# EAGLE schematic ShutdownThree (EAGLE 7.7.0)
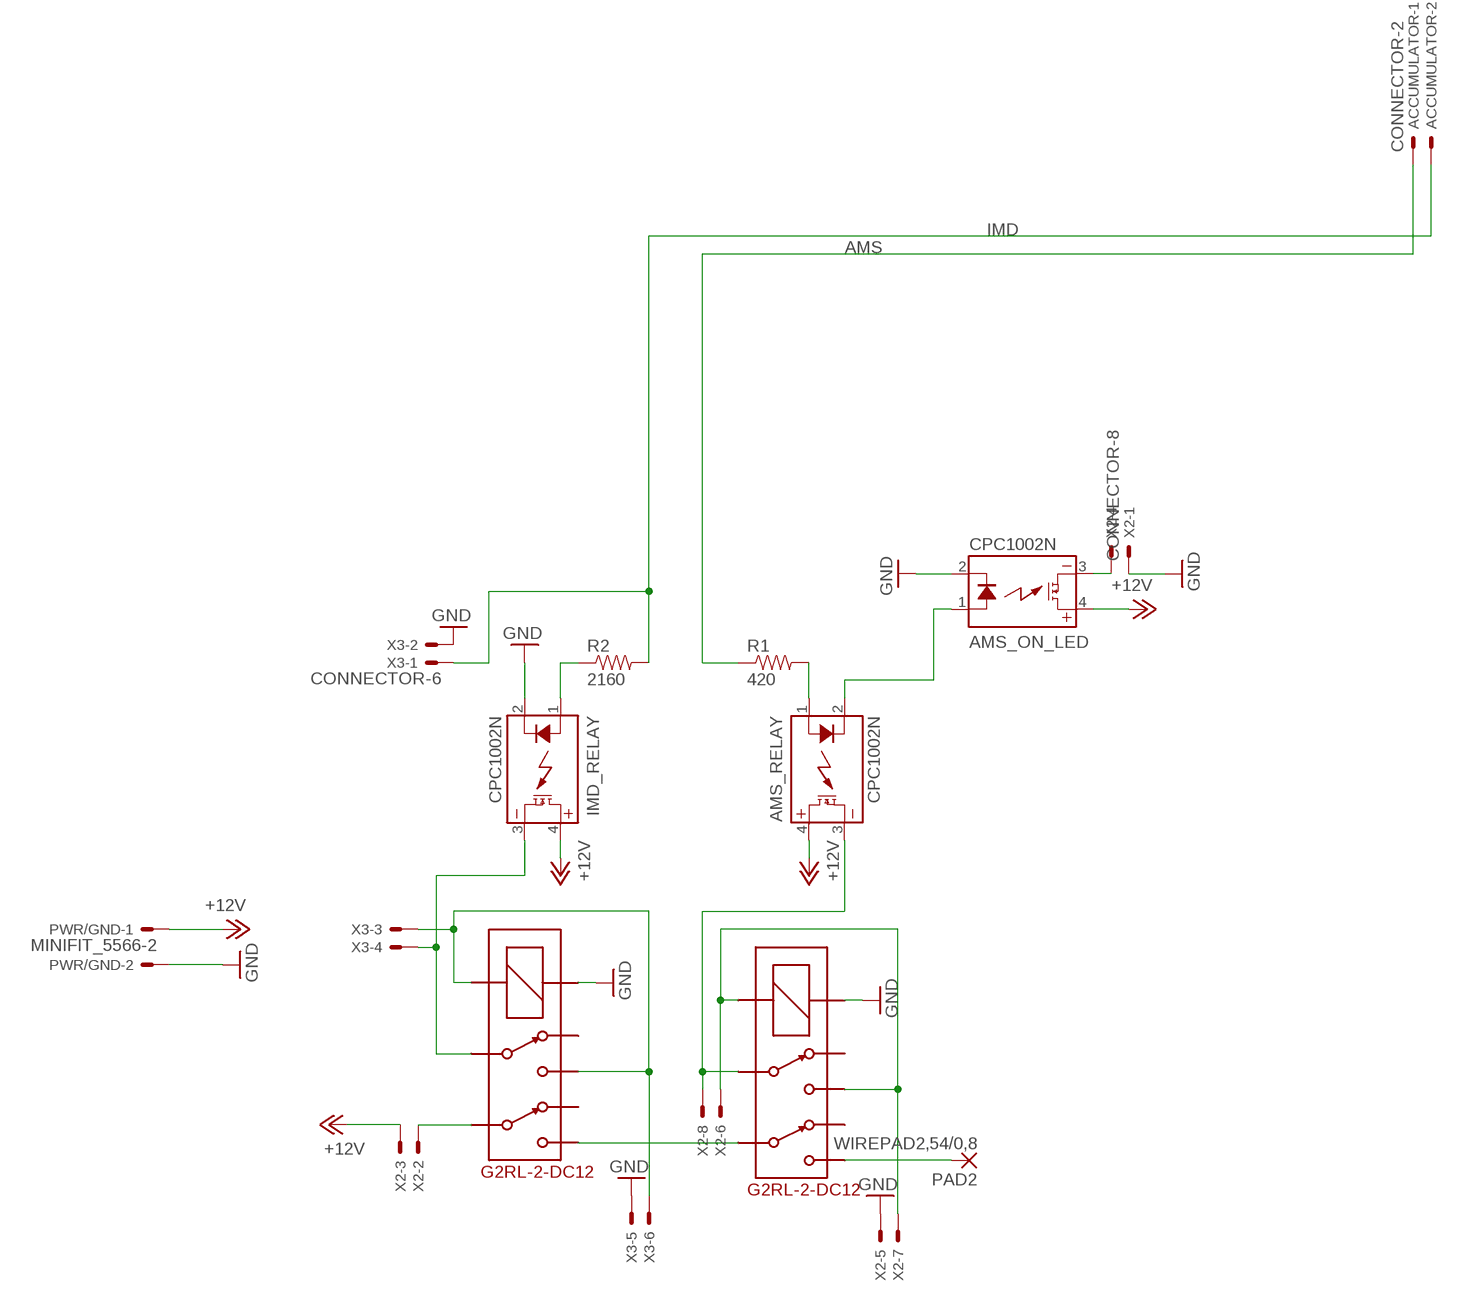
[diagram p0: schematic, sheet 1]

## Parts
ACCUMULATOR  CONNECTOR-2  [MINIFIT_5566-2]
AMS_ON_LED  CPC1002N  [SOP04]
AMS_RELAY  CPC1002N  [SOP04]
IMD  G2RL-2-DC12  [G2RL-2]
IMD_RELAY  CPC1002N  [SOP04]
PAD2  WIREPAD2,54/0,8  [2,54/0,8]
PWR/GND  MINIFIT_5566-2  [MINIFIT_5566-2]
R1  420  RESISTOREZ  [AXIAL-0.3EZ]
R2  2160  RESISTOREZ  [AXIAL-0.3EZ]
U$7  G2RL-2-DC12  [G2RL-2]
X2  CONNECTOR-8  [MINIFIT_5566-8]
X3  CONNECTOR-6  [MINIFIT_5566-6]

## Nets
+12V: AMS_ON_LED.4(DC+) AMS_RELAY.4(DC+) IMD_RELAY.4(DC+) PWR/GND.1 X2.3
AMS: ACCUMULATOR.1 R1.P$1
GND: AMS_ON_LED.2(CONTROL-) IMD.COIL+ IMD_RELAY.2(CONTROL-) PWR/GND.2 U$7.COIL+ X2.1 X2.5 X3.2 X3.5
IMD: ACCUMULATOR.2 R2.P$2 X3.1
N$1: IMD.6 X2.2
N$2: IMD.5 U$7.6
N$3: AMS_ON_LED.3(DC-) X2.4
N$4: AMS_RELAY.1(CONTROL+) R1.P$2
N$5: AMS_RELAY.3(DC-) U$7.3 X2.8
N$10: PAD2.1(P) U$7.5
N$12: IMD.3 IMD_RELAY.3(DC-) X3.4
N$14: IMD_RELAY.1(CONTROL+) R2.P$1
N$17: U$7.4 U$7.COIL- X2.6 X2.7
N$22: IMD.4 IMD.COIL- X3.3 X3.6
N$24: AMS_ON_LED.1(CONTROL+) AMS_RELAY.2(CONTROL-)
Unconnected: IMD.2 IMD.7 U$7.2 U$7.7

## Library data of the parts
ACCUMULATOR = HyTechDevices:CONNECTOR-2: Mini-Fit Junior connector 2 pole Source: http://www.molex.com; OC_FARNELL: 1822072; OC_NEWARK: unknown
AMS_ON_LED AMS_RELAY IMD_RELAY = HyTechDevices:CPC1002N: IXYS Solid State Relay .7A
IMD U$7 = HyTechDevices:G2RL-2-DC12: Omron G2RL-2 Double Pull Double Throw Relay Coil Voltage: 12VDC (8.4-18VDC @60ºC) Contact Amperage: 8A at 30VDC Datasheet <https://www.omron.com/ecb/products/pdf/en-g2rl.pdf>
PAD2 = wirepad:WIREPAD: Wire PAD connect wire on PCB
PWR/GND = HyTechDevices:MINIFIT_5566-2: Mini-Fit Junior connector 2 pole Source: http://www.molex.com; OC_FARNELL: 1822072; OC_NEWARK: unknown
R1 R2 = HyTechDevices:RESISTOR: Resistor Basic schematic elements and footprints for 0603, 1206, and PTH resistors.
X2 = HyTechDevices:CONNECTOR-8: Mini-Fit Junior connector 8 pole Source: http://www.molex.com; OC_FARNELL: unknown; OC_NEWARK: unknown
X3 = HyTechDevices:CONNECTOR-6: Mini-Fit Junior connector 6 pole Source: http://www.molex.com; MPN: 95566-61002; OC_FARNELL: unknown; OC_NEWARK: 22K8620